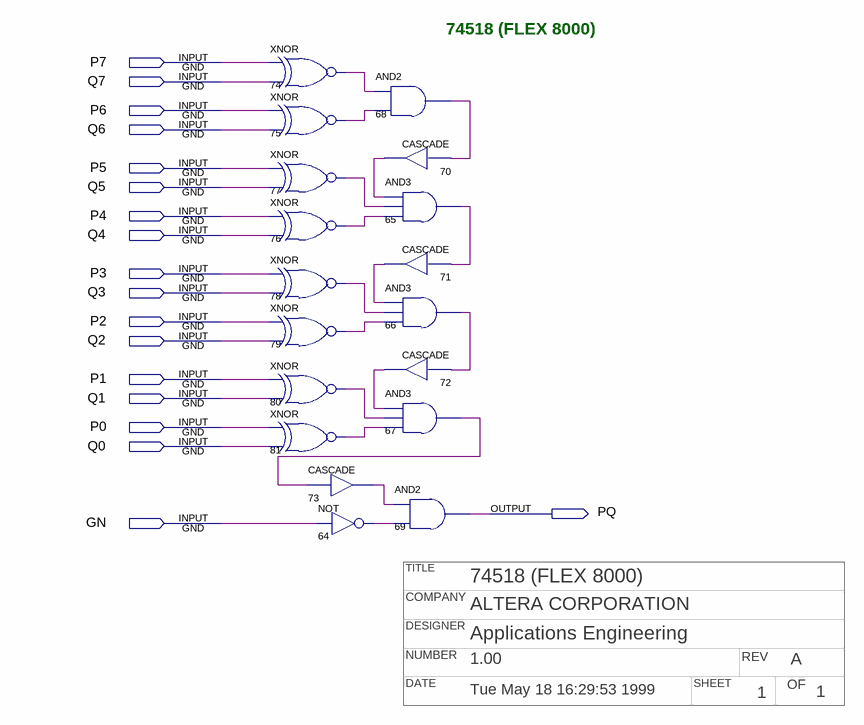
[diagram p0: schematic sheet]
// Quartus schematic f74518b.bdf as structural Verilog: 18 symbols, 18 pins
// Title block: TITLE: 74518 (FLEX 8000); COMPANY: ALTERA CORPORATION; DESIGNER: Applications Engineering; NUMBER: 1.00; REV: A; DATE: Tue May 18 16:29:53 1999; SHEET: 1; OF: 1
module f74518b (
  input  P7,
  input  Q7,
  input  P6,
  input  Q6,
  input  P5,
  input  Q5,
  input  P4,
  input  Q4,
  input  P3,
  input  Q3,
  input  P2,
  input  Q2,
  input  P1,
  input  Q1,
  input  P0,
  input  Q0,
  input  GN,
  output PQ
);

  wire n64_out, n65_out, n66_out, n67_out, n68_out, n70_out, n71_out, n72_out, n73_out, n74_out, n75_out,
       n76_out, n77_out, n78_out, n79_out, n80_out, n81_out;

  xnor u_74 (n74_out, P7, Q7);
  xnor u_75 (n75_out, P6, Q6);
  xnor u_77 (n77_out, P5, Q5);
  xnor u_76 (n76_out, P4, Q4);
  xnor u_78 (n78_out, P3, Q3);
  xnor u_79 (n79_out, P2, Q2);
  xnor u_80 (n80_out, P1, Q1);
  xnor u_81 (n81_out, P0, Q0);
  CASCADE u_73 (.IN(n67_out), .OUT(n73_out));
  not u_64 (n64_out, GN);
  and u_68 (n68_out, n74_out, n75_out);
  CASCADE u_70 (.IN(n68_out), .OUT(n70_out));
  and u_65 (n65_out, n70_out, n77_out, n76_out);
  CASCADE u_71 (.IN(n65_out), .OUT(n71_out));
  and u_66 (n66_out, n71_out, n78_out, n79_out);
  CASCADE u_72 (.IN(n66_out), .OUT(n72_out));
  and u_67 (n67_out, n72_out, n80_out, n81_out);
  and u_69 (PQ, n73_out, n64_out);

  // Notes on the sheet:
  //   74518 (FLEX 8000)
endmodule
